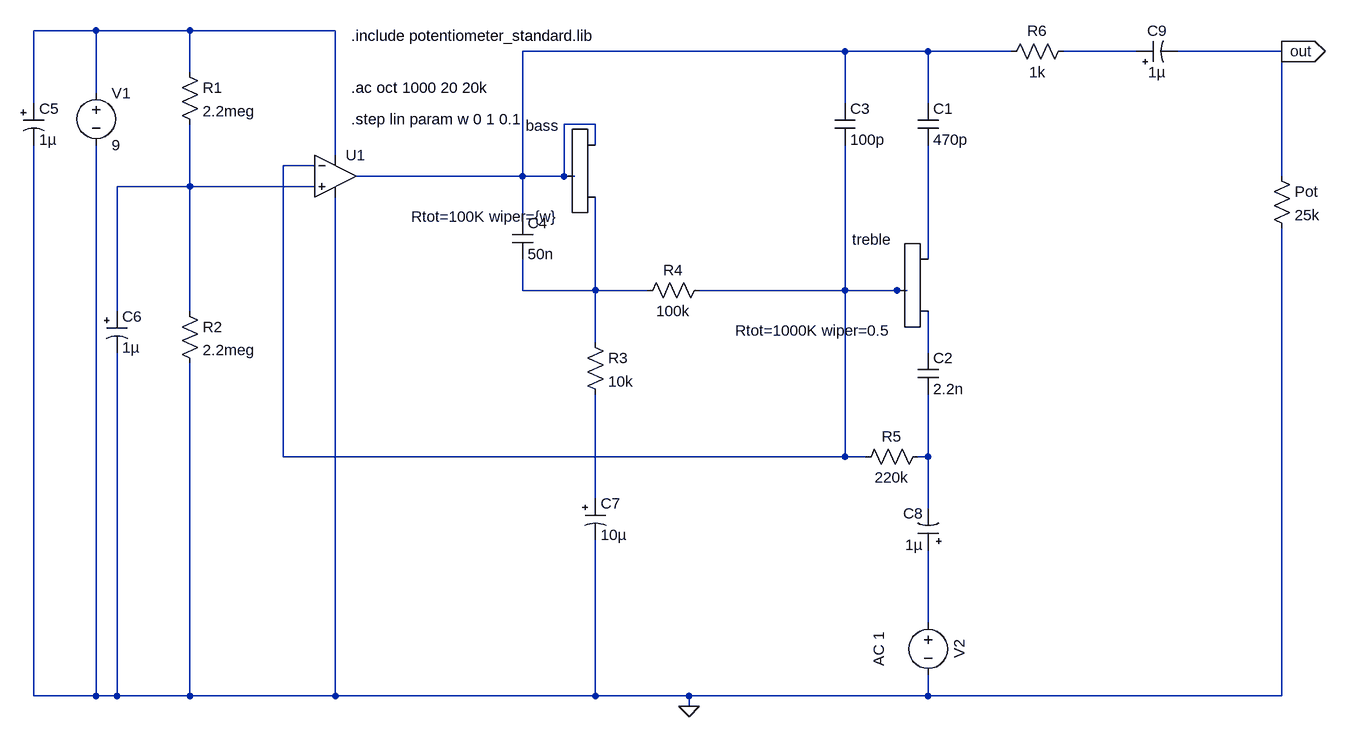
[diagram p0: schematic MM 2b.asc]
MM 2b.asc, the LTspice schematic file:
Version 4
SHEET 1 1272 972
WIRE -720 -160 -816 -160
WIRE -576 -160 -720 -160
WIRE -352 -160 -576 -160
WIRE 432 -128 -64 -128
WIRE 560 -128 432 -128
WIRE 688 -128 560 -128
WIRE 880 -128 768 -128
WIRE 1104 -128 944 -128
WIRE -576 -96 -576 -160
WIRE -720 -64 -720 -160
WIRE -816 -48 -816 -160
WIRE 432 -48 432 -128
WIRE 560 -48 560 -128
WIRE 48 -16 0 -16
WIRE 48 16 48 -16
WIRE -352 32 -352 -160
WIRE -384 48 -432 48
WIRE -64 64 -64 -128
WIRE -64 64 -320 64
WIRE 0 64 0 -16
WIRE 0 64 -64 64
WIRE 16 64 0 64
WIRE 1104 64 1104 -128
WIRE -576 80 -576 -16
WIRE -576 80 -688 80
WIRE -384 80 -576 80
WIRE -64 128 -64 64
WIRE 560 192 560 16
WIRE -64 240 -64 192
WIRE 48 240 48 96
WIRE 48 240 -64 240
WIRE 128 240 48 240
WIRE 432 240 432 16
WIRE 432 240 208 240
WIRE 512 240 432 240
WIRE 528 240 512 240
WIRE -688 272 -688 80
WIRE -576 272 -576 80
WIRE 48 320 48 240
WIRE 560 336 560 272
WIRE -432 496 -432 48
WIRE 432 496 432 240
WIRE 432 496 -432 496
WIRE 464 496 432 496
WIRE 560 496 560 400
WIRE 560 496 544 496
WIRE 48 560 48 400
WIRE 560 576 560 496
WIRE 560 752 560 640
WIRE -816 864 -816 16
WIRE -720 864 -720 16
WIRE -720 864 -816 864
WIRE -688 864 -688 336
WIRE -688 864 -720 864
WIRE -576 864 -576 352
WIRE -576 864 -688 864
WIRE -352 864 -352 96
WIRE -352 864 -576 864
WIRE 48 864 48 624
WIRE 48 864 -352 864
WIRE 192 864 48 864
WIRE 560 864 560 832
WIRE 560 864 192 864
WIRE 1104 864 1104 144
WIRE 1104 864 560 864
WIRE 192 880 192 864
FLAG 192 880 0
FLAG 1104 -128 out
IOPIN 1104 -128 Out
SYMBOL res -592 -112 R0
SYMATTR InstName R1
SYMATTR Value 2.2meg
SYMBOL res -592 256 R0
SYMATTR InstName R2
SYMATTR Value 2.2meg
SYMBOL res 32 304 R0
SYMATTR InstName R3
SYMATTR Value 10k
SYMBOL res 224 224 R90
WINDOW 0 0 56 VBottom 2
WINDOW 3 32 56 VTop 2
SYMATTR InstName R4
SYMATTR Value 100k
SYMBOL res 560 480 R90
WINDOW 0 0 56 VBottom 2
WINDOW 3 32 56 VTop 2
SYMATTR InstName R5
SYMATTR Value 220k
SYMBOL res 784 -144 R90
WINDOW 0 0 56 VBottom 2
WINDOW 3 32 56 VTop 2
SYMATTR InstName R6
SYMATTR Value 1k
SYMBOL cap 544 -48 R0
SYMATTR InstName C1
SYMATTR Value 470p
SYMBOL cap 544 336 R0
SYMATTR InstName C2
SYMATTR Value 2.2n
SYMBOL cap 416 -48 R0
SYMATTR InstName C3
SYMATTR Value 100p
SYMBOL cap -80 128 R0
SYMATTR InstName C4
SYMATTR Value 50n
SYMBOL polcap -832 -48 R0
SYMATTR InstName C5
SYMATTR Value 1µ
SYMBOL polcap -704 272 R0
SYMATTR InstName C6
SYMATTR Value 1µ
SYMBOL polcap 32 560 R0
SYMATTR InstName C7
SYMATTR Value 10µ
SYMBOL polcap 576 640 R180
WINDOW 0 24 57 Left 2
WINDOW 3 24 8 Left 2
SYMATTR InstName C8
SYMATTR Value 1µ
SYMBOL polcap 880 -112 R270
WINDOW 0 32 32 VTop 2
WINDOW 3 0 32 VBottom 2
SYMATTR InstName C9
SYMATTR Value 1µ
SYMBOL voltage -720 -80 R0
WINDOW 123 0 0 Left 2
WINDOW 39 0 0 Left 2
SYMATTR InstName V1
SYMATTR Value 9
SYMBOL voltage 560 736 R0
WINDOW 0 32 56 VTop 2
WINDOW 3 -88 56 VBottom 2
WINDOW 123 -60 56 VBottom 2
WINDOW 39 0 0 Left 2
SYMATTR InstName V2
SYMATTR Value ""
SYMATTR Value2 AC 1
SYMBOL res 1088 48 R0
SYMATTR InstName Pot
SYMATTR Value 25k
SYMBOL potentiometer_standard 64 0 M0
WINDOW 39 48 112 Invisible 2
WINDOW 38 48 41 Invisible 2
SYMATTR SpiceLine Rtap=16k tap=0.5
SYMATTR SpiceModel pot_plog
SYMATTR InstName bass
SYMATTR Value Rtot=100K wiper={w}
SYMBOL potentiometer_standard 576 176 M0
WINDOW 38 48 41 Invisible 2
WINDOW 39 48 112 Invisible 2
SYMATTR SpiceModel pot_nlog
SYMATTR SpiceLine Rtap=140k tap=0.5
SYMATTR InstName treble
SYMATTR Value Rtot=1000K wiper=0.5
SYMBOL Opamps\\UniversalOpamp2 -352 64 R0
SYMATTR InstName U1
TEXT -328 -72 Left 2 !.ac oct 1000 20 20k
TEXT -328 -152 Left 2 !.include potentiometer_standard.lib
TEXT -328 -24 Left 2 !.step lin param w 0 1 0.1

The netlist it stands for:
* MM 2b.asc
R1 N001 N005 2.2meg
R2 N005 0 2.2meg
R3 N007 N010 10k
R4 N004 N007 100k
R5 N009 N004 220k
R6 N003 N002 1k
C1 N002 N006 470p
C2 N008 N009 2.2n
C3 N002 N004 100p
C4 N002 N007 50n
C5 N001 0 1µ
C6 N005 0 1µ
C7 N010 0 10µ
C8 N011 N009 1µ
C9 N003 out 1µ
V1 N001 0 9
V2 N011 0 AC 1
R§Pot out 0 25k
Xbass N002 N007 N002 pot_plog Rtot=100K wiper={w} Rtap=16k tap=0.5
Xtreble N006 N008 N004 pot_nlog Rtot=1000K wiper=0.5 Rtap=140k tap=0.5
XU1 N005 N004 N001 0 N002 level.2 Avol=1Meg GBW=10Meg Slew=10Meg ilimit=25m rail=0 Vos=0 phimargin=45 en=0 enk=0 in=0 ink=0 Rin=500Meg  ; pins IN+ IN- V+ V- OUT
.ac oct 1000 20 20k
.include potentiometer_standard.lib
.step lin param w 0 1 0.1
.lib UniversalOpamps2.sub
.backanno
.end